# Altium project barcode Reader4.2 -version 2.PrjPcb
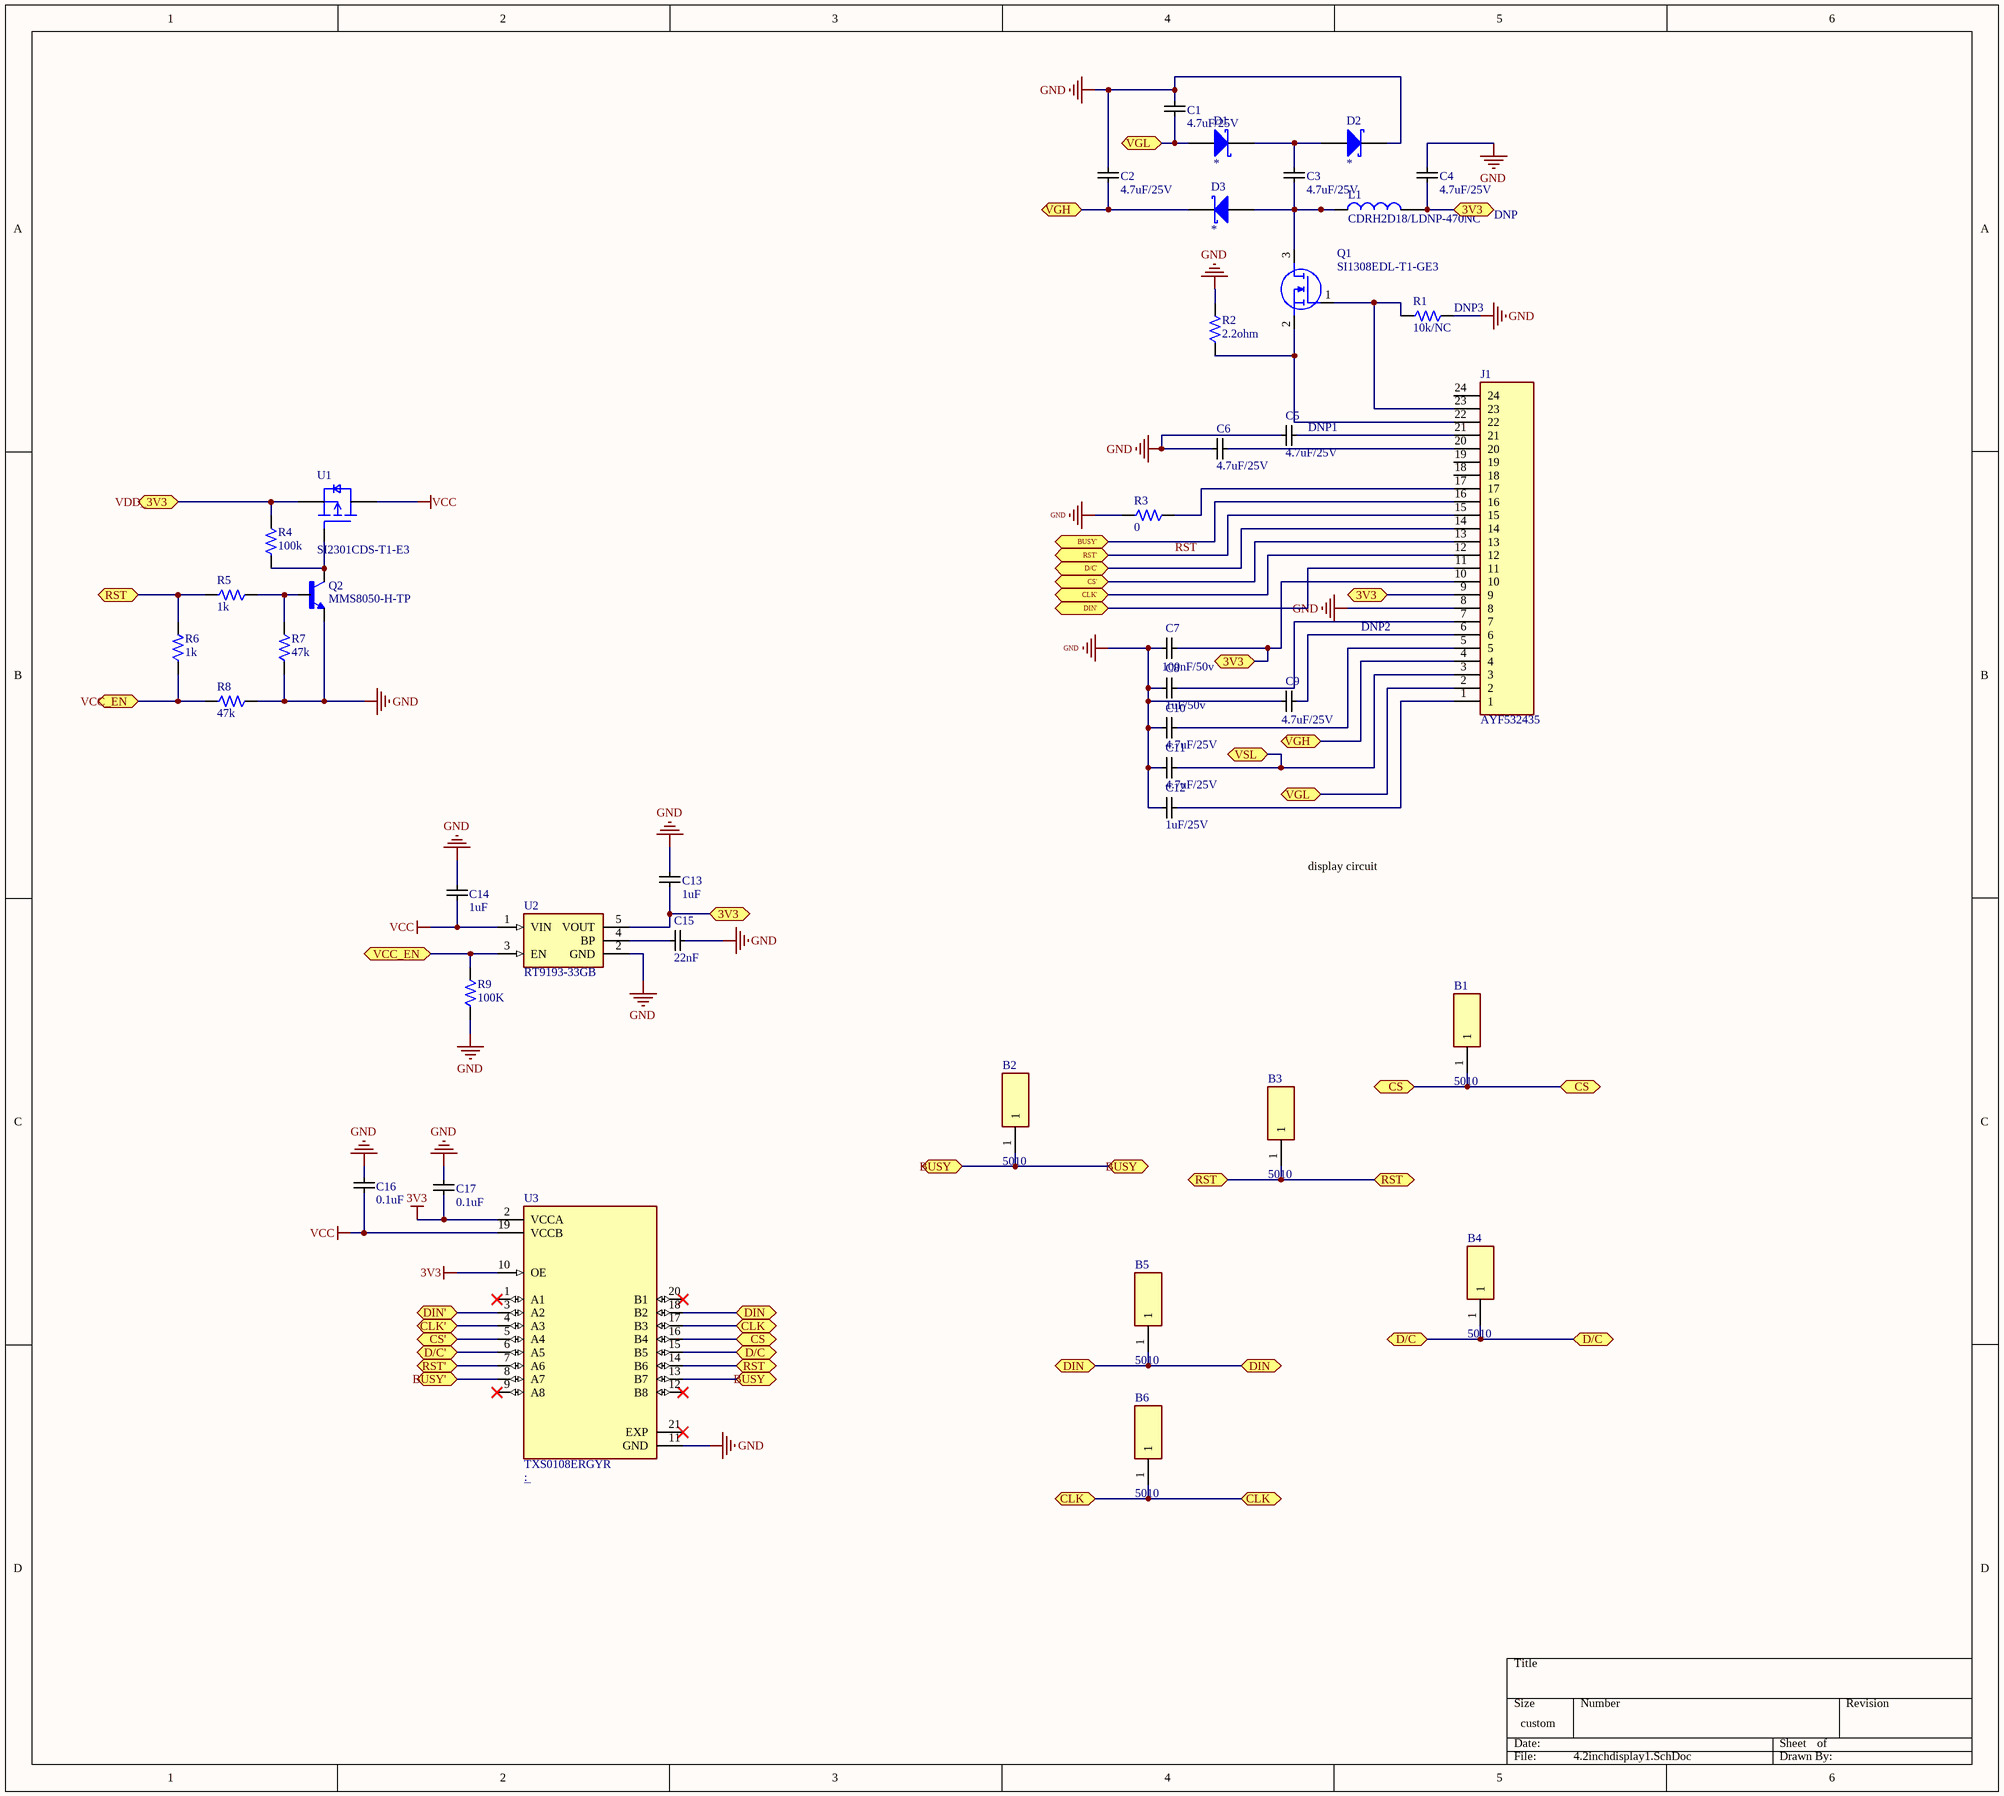
[diagram p0: 4.2inchdisplay1.SchDoc]
2 sheets, 87 parts. Net scope: flat (ports and power ports of the same name join across sheets).
Board file: 4.2inchbarcode1.PcbDoc
Sheets:
  4.2inchdisplay1.SchDoc
  microcontroller_board2.SchDoc

## Sheet 4.2inchdisplay1.SchDoc
size 381 x 341 mm; SheetNumber: 1; SheetTotal: 2

### Parts
B1  5010  [5010]
B2  5010  [5010]
B3  5010  [5010]
B4  5010  [5010]
B5  5010  [5010]
B6  5010  [5010]
C1  4.7uF/25V  [Cap_0805]
C2  4.7uF/25V  [Cap_0805]
C3  4.7uF/25V  [Cap_0805]
C4  4.7uF/25V  [Cap_0805]
C5  4.7uF/25V  [Cap_0805]
C6  4.7uF/25V  [Cap_0805]
C7  100nF/50v  [Cap_0603]
C8  1uF/50v  [Cap_0603]
C9  4.7uF/25V  [Cap_0805]
C10  4.7uF/25V  [Cap_0805]
C11  4.7uF/25V  [Cap_0805]
C12  1uF/25V  [Cap_0805]
C13  1uF  [Cap_0603]
C14  1uF  [Cap_0603]
C15  22nF  [Cap_0603]
C16  0.1uF  [Cap_0603]
C17  0.1uF  [Cap_0603]
D1  *  [ON_Semi_SOD-123F_0]
D2  *  [ON_Semi_SOD-123F_0]
D3  *  [ON_Semi_SOD-123F_0]
J1  AYF532435  [PANASONIC_AYF532435]
L1  CDRH2D18/LDNP-470NC  [IND_CDRH2D18/HPNP-1R1NC]
Q1  SI1308EDL-T1-GE3  [SOT65P210X110-3N]
Q2  MMS8050-H-TP  [SOT23-BEC]
R1  10k/NC  [RES_0805]
R2  2.2ohm  [RES_0805]
R3  0  [RES_0603]
R4  100k  [RES_0603]
R5  1k  [RES_0603]
R6  1k  [RES_0603]
R7  47k  [RES_0603]
R8  47k  [RES_0603]
R9  100K  [RES_0603]
U1  SI2301CDS-T1-E3  [SOT23-3]
U2  RT9193-33GB  [SOT94P279X129-5N]
U3  TXS0108ERGYR  [IC_TXS0108ERGYR]

### Ports
3V3 (bidir), BUSY (bidir), BUSY' (bidir), CLK (bidir), CLK' (bidir), CS (bidir), CS' (bidir), D/C (bidir), D/C' (bidir), DIN (bidir), DIN' (bidir), RST (bidir), RST' (bidir), VCC_EN (bidir), VDD_3V3 (bidir), VGH (bidir), VGL (bidir), VSL (bidir)

### Nets
3V3: C17.2 U3.2(VCCA) U3.10(OE)
GND: C1.2 C2.2 C4.2 C5.1 C6.1 C7.1 C8.1 C9.1 C10.1 C11.1 C12.1 C13.2 C14.2 C15.2 C16.2 C17.1 D2.1(K) J1.8 Q2.E R1.2 R2.2 R3.1 R7.1 R8.2 R9.1 U2.2(GND) U3.11(GND)
VCC: C14.1 C16.1 U1.3(D) U2.1(VIN) U3.19(VCCB)
RST: J1.15 U3.7(A6) ; port RST'
NetB1_1: B1.1 U3.16(B4) ; port CS
NetB2_1: B2.1 U3.13(B7) ; port BUSY
NetB3_1: B3.1 R5.1 R6.2 U3.14(B6) ; port RST
NetB4_1: B4.1 U3.15(B5) ; port D/C
NetB5_1: B5.1 U3.18(B2) ; port DIN
NetB6_1: B6.1 U3.17(B3) ; port CLK
NetC1_1: C1.1 D1.2(A) J1.2 ; port VGL
NetC2_1: C2.1 D3.1(K) J1.4 ; port VGH
NetC3_1: C3.1 D3.2(A) L1.1 Q1.3(D)
NetC3_2: C3.2 D1.1(K) D2.2(A)
NetC4_1: C4.1 C7.2 C13.1 J1.9 J1.10 L1.2 U2.5(VOUT) ; port 3V3
NetC5_2: C5.2 J1.21
NetC6_2: C6.2 J1.20
NetC8_2: C8.2 J1.7
NetC9_2: C9.2 J1.6
NetC10_2: C10.2 J1.5
NetC11_2: C11.2 J1.3 ; port VSL
NetC12_2: C12.2 J1.1
NetC15_1: C15.1 U2.4(BP)
NetJ1_11: J1.11 U3.3(A2) ; port DIN'
NetJ1_12: J1.12 U3.4(A3) ; port CLK'
NetJ1_13: J1.13 U3.5(A4) ; port CS'
NetJ1_14: J1.14 U3.6(A5) ; port D/C'
NetJ1_16: J1.16 U3.8(A7) ; port BUSY'
NetJ1_17: J1.17 R3.2
NetJ1_22: J1.22 Q1.2(S) R2.1
NetJ1_23: J1.23 Q1.1(G) R1.1
NetQ2_B: Q2.B R5.2 R7.2
NetQ2_C: Q2.C R4.1 U1.1(G)
NetR4_2: R4.2 U1.2(S) ; port VDD_3V3
NetR6_1: R6.1 R8.1 R9.2 U2.3(EN) ; port VCC_EN

Not connected (* = marked no-connect by the designer): J1 18 19 24; U3 1(A1)* 9(A8)* 12(B8)* 20(B1)* 21(EXP)*

### Notes on the sheet
- DNP
- (near R1) DNP3
- (near C5) DNP1
- DNP2
- display circuit

### Library data of the parts
B1-B6 = 5010: KEYSTONE - 5010 - TEST POINT, PCB, THROUGH HOLE; Manufacturer_Name: Keystone Electronics; Geometry.Height: 8.28mm; Manufacturer_Part_Number: 5010; Mouser Part Number: 534-5010; Mouser Price/Stock: https://www.mouser.co.uk/ProductDetail/Keystone-Electronics/5010?qs=qOqV1E1P08SzD%252BWfk1wMXQ%3D%3D; Arrow Part Number: 5010; Arrow Price/Stock: https://www.arrow.com/en/products/5010/keystone-electronics?region=europe; Datasheet Link: http://www.farnell.com/datasheets/1703983.pdf; MP: 5010
C1-C6 = CAP_0805: MP: KAM15AR71H104KM; Voltage Rating: *; Tolerance: *; Package Size: CAP_0805; Capacitance: *
  C5 C6: Parameter 1: *
C7 = CAP_0603: KAM15AR71H104KM; Voltage Rating: *; Tolerance: *; Package Size: CAP_0603; MP: KAM15AR71H104KM; Parameter 1: *
C8 = CAP_0603: UMK107AB7105KA-T; Voltage Rating: *; Tolerance: *; Package Size: CAP_0603; MP: UMK107AB7105KA-T; Parameter 1: *
C9-C11 = CAP_0805: TMK212AB7475KG-T; Voltage Rating: *; Tolerance: *; Package Size: CAP_0805; Capacitance: *; MP: TMK212AB7475KG-T; Parameter 1: *
C12 = CAP_0805: MCAST21GSB7105MTNB25; Voltage Rating: *; Tolerance: *; Package Size: CAP_0805; Capacitance: *; MP: MCAST21GSB7105MTNB25; Parameter 1: *
C13 C14 = CAP_0603: GRT188R61H105KE13D; Voltage Rating: *; Tolerance: *; Package Size: CAP_0603; MP: GRT188R61H105KE13D
C15 = CAP_0603: GCM188R71H223KA37J; Voltage Rating: *; Tolerance: *; Package Size: CAP_0603; MP: GCM188R71H223KA37J
C16 = CAP_0603: MP: GCM188R71H104KA57J; Voltage Rating: *; Tolerance: *; Package Size: CAP_0603
C17 = CAP_0603: GCM188R71H104KA57J; Voltage Rating: *; Tolerance: *; Package Size: CAP_0603; MP: GCM188R71H104KA57J
D1-D3 = Schottky Diode: Schottky Barrier Rectifier, 40 V Maximum DC Blocking Voltage, -65 to 125 degC, 2-Pin SMA Case, RoHS; MF: CDRH2D18/LDNP-470NC; ComponentLink1Description: Manufacturer URL; ComponentLink2Description: Datasheet; ComponentLink3URL: http://www.vishay.com/docs/88746/ss12.pdf; ComponentLink3Description: Package Specification; ComponentLink1URL: http://www.vishay.com/; ComponentLink2URL: http://www.vishay.com/docs/88746/ss12.pdf; MP: CDRH2D18/LDNP-470NC; Value: *; Parameter 1: *
J1 = AYF532435: 24 Position FFC, FPC Connector Contacts, Top and Bottom 0.020 (0.50mm) Surface Mount, Right Angle; MF: Panasonic Electric Works; Availability: In Stock; SnapEDA_Link: https://www.snapeda.com/parts/AYF532435/Panasonic/view-part/3222527/?ref=snap; MP: AYF532435; Value: *; Price: None; Package: None; Check_prices: https://www.snapeda.com/parts/AYF532435/Panasonic/view-part/3222527/?ref=eda; Purchase-URL: https://pricing.snapeda.com/search/part/AYF532435/?ref=eda; Parameter 1: *
L1 = CDRH2D18/HPNP-1R1NC: Power Inductors - SMD 47uH 0.48A 530ohms; MF: CDRH2D18/LDNP-470NC; Package: None; Price: None; Value: *; MP: CDRH2D18/LDNP-470NC; Availability: Unavailable; Parameter 1: *
Q1 = SI1308EDL-T1-GE3: N-Channel 30V 1.4A (Tc) 400mW (Ta), 500mW (Tc) Surface Mount SC-70-3; MF: Vishay Siliconix; MP: SI1308EDL-T1-GE3; Value: *; Check_prices: https://www.snapeda.com/parts/SI1308EDL-T1-GE3/Vishay%20Siliconix/view-part/5506696/?ref=eda; SnapEDA_Link: https://www.snapeda.com/parts/SI1308EDL-T1-GE3/Vishay%20Siliconix/view-part/5506696/?ref=snap; Price: None; Availability: In Stock; Purchase-URL: https://pricing.snapeda.com/search/part/SI1308EDL-T1-GE3/?ref=eda; Package: SOT-323 Vishay Semiconductor; Parameter 1: *
Q2 = MMBT2222*: Bipolar (BJT) Transistor NPN 30 V 600 mA 250MHz 300 mW Surface Mount SOT-23-3 (TO-236); MF: ON Semiconductor; Check_prices: https://www.snapeda.com/parts/MMBT2222/Onsemi/view-part/?ref=eda; Value: *; Availability: In Stock; MP: MMS8050-H-TP; Price: None; Package: SOT-23-3 Fairchild Semiconductor; SnapEDA_Link: https://www.snapeda.com/parts/MMBT2222/Onsemi/view-part/?ref=snap; Parameter 1: *
R1 = RES_0805: AC0603FR-0710KL; Power Rating: *; Tolerance: *; Package Size: RES_0805; MP: AC0603FR-0710KL; Parameter 1: *
R2 = RES_0805: CRCW08052R20FKEAHP; Power Rating: *; Tolerance: *; Package Size: RES_0805; MP: CRCW08052R20FKEAHP; Parameter 1: *
R3 = RES_0603: AC0603FR-070RL; Power Rating: *; Tolerance: *; Package Size: *; MP: AC0603FR-070RL; Parameter 1: *
R4 R9 = RES_0603: AC0603FR-07100KL; Power Rating: *; Tolerance: *; Package Size: *; MP: AC0603FR-07100KL
R5 R6 = RES_0603: AC0603FR-071KL; Power Rating: *; Tolerance: *; Package Size: *; MP: AC0603FR-071KL
R7 = RES_0603: RC0603FR-0747KL; Power Rating: *; Tolerance: *; Package Size: *; MP: RC0603FR-0747KL
R8 = RES_0603: MP: RC0603FR-0747KL; Power Rating: *; Tolerance: *; Package Size: *
U1 = AO3401: P-Channel 30 V 4A (Ta) 1.4W (Ta) Surface Mount SOT-23-3; MF: Alpha &; SnapEDA_Link: https://www.snapeda.com/parts/AO3401/Alpha+%2526+Omega+Semiconductor+Inc./view-part/?ref=snap; Package: TO-236-3 Alpha &amp; Omega Semiconductor Inc.; Value: *; MP: SI2301CDS-T1-E3; Check_prices: https://www.snapeda.com/parts/AO3401/Alpha+%2526+Omega+Semiconductor+Inc./view-part/?ref=eda; Parameter 1: *
U2 = RT9193-33GB: Linear Voltage Regulator IC Positive Fixed 1 Output 300mA TSOT-23-5; MF: Richtek USA; SnapEDA_Link: https://www.snapeda.com/parts/RT9193-33GB/Richtek+USA+Inc./view-part/?ref=snap; Package: SOT-23-5 Richtek; MP: RT9193-33GB; Check_prices: https://www.snapeda.com/parts/RT9193-33GB/Richtek+USA+Inc./view-part/?ref=eda; Purchase-URL: https://pricing.snapeda.com/search/part/RT9193-33GB/?ref=eda; Digi-Key_Part_Number: 1028-1014-2-ND; Value: *; Parameter 1: *
U3 = TXS0108ERGYR: 8-bit bidirectional voltage-level shifter for open-drain and push-pull application 20-VQFN -40 to 85; MF: Texas Instruments; Package: VQFN-20 Texas Instruments; Availability: Unavailable; MP: TXS0108ERGYR; SnapEDA_Link: https://www.snapeda.com/parts/TXS0108ERGYR/Texas%20Instruments/view-part/46552/?ref=snap; Purchase-URL: https://pricing.snapeda.com/search/part/TXS0108ERGYR/?ref=eda; Value: *; Price: None; Parameter 1: *

## Sheet microcontroller_board2.SchDoc
size 580 x 341 mm; SheetNumber: 2; SheetTotal: 2
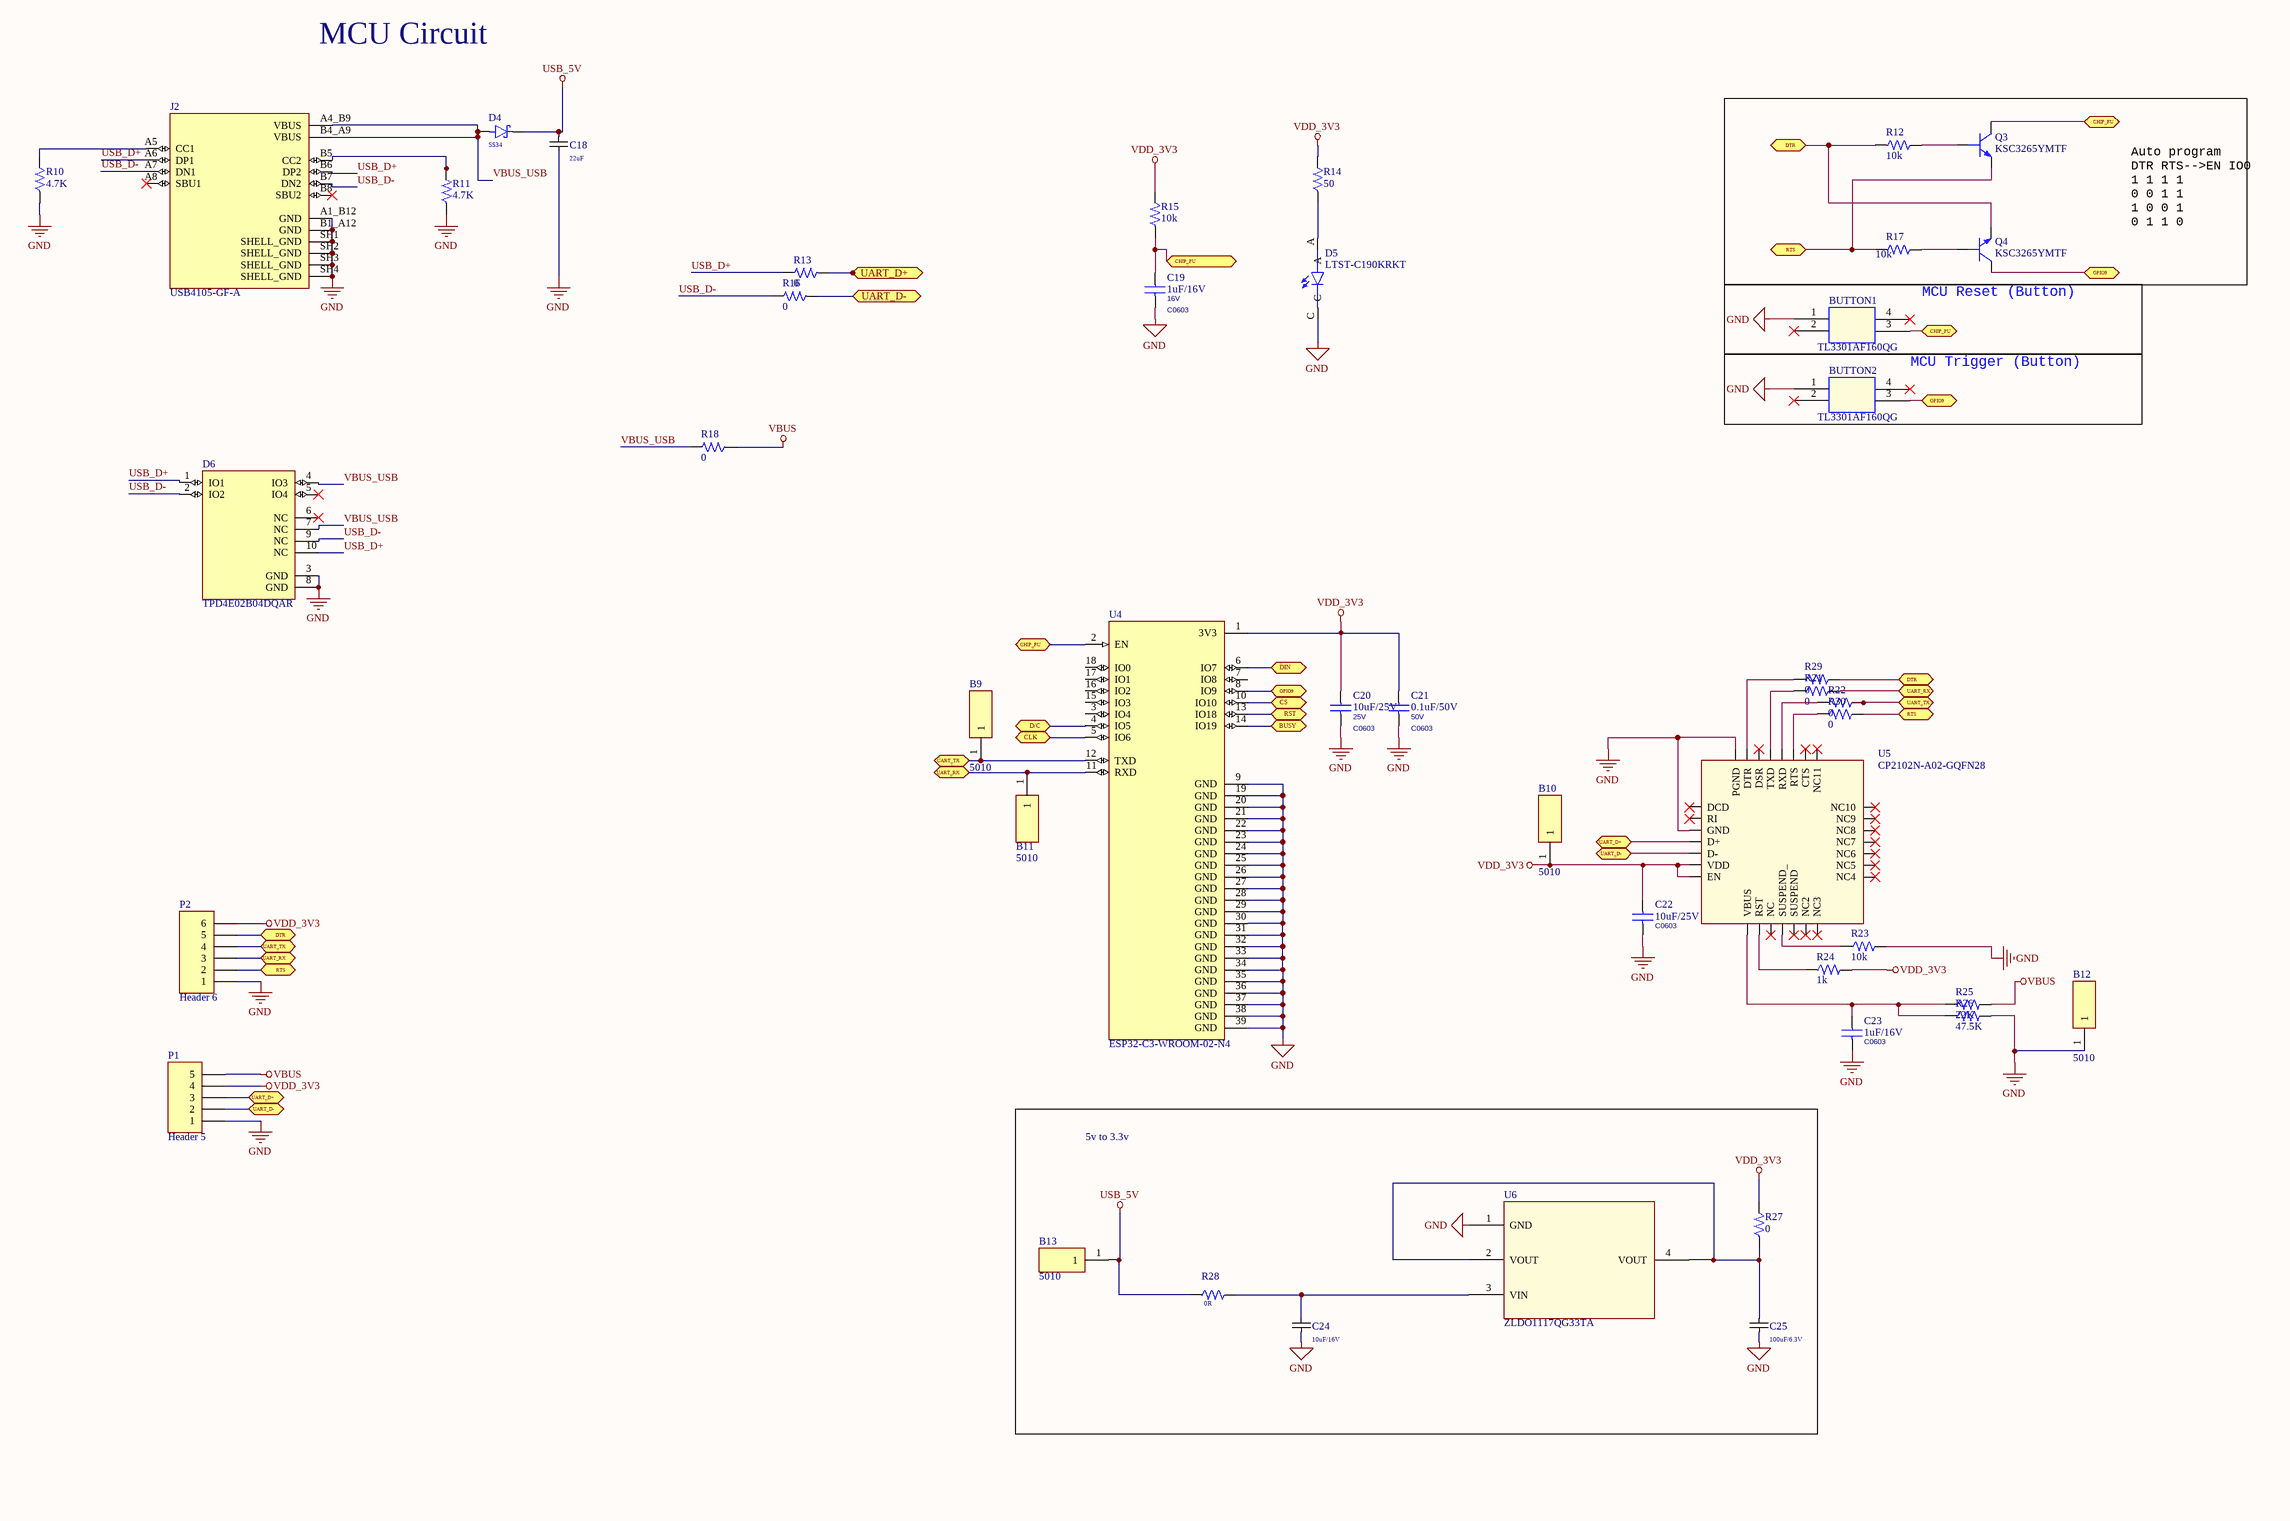
[diagram p1: microcontroller_board2.SchDoc]

### Parts
B9  5010  [5010]
B10  5010  [5010]
B11  5010  [5010]
B12  5010  [5010]
B13  5010  [5010]
BUTTON1  TL3301AF160QG  [TL3301AF160QG]
BUTTON2  TL3301AF160QG  [TL3301AF160QG]
C18  22uF  [Cap_0805]
C19  1uF/16V  PCB Footprint: C0603  Voltage: 16V  [Cap_0603]
C20  10uF/25V  Voltage: 25V  PCB Footprint: C0603  [Cap_0603]
C21  0.1uF/50V  Voltage: 50V  PCB Footprint: C0603  [Cap_0603]
C22  10uF/25V  PCB Footprint: C0603  [Cap_0603]
C23  1uF/16V  PCB Footprint: C0603  [Cap_0603]
C24  10uF/16V  [Cap_0603]
C25  100uF/6.3V  [Cap_0805]
D4  SS34  [DIOM7959X265N]
D5  LTST-C190KRKT  [LEDM1608X80]
D6  TPD4E02B04DQAR  [DIO_TPD4E02B04DQAR]
J2  USB4105-GF-A  [GCT_USB4105-GF-A]
P1  Header 5  [HDR1X5]
P2  Header 6  [HDR1X6]
Q3  KSC3265YMTF  [KSC3265YMTF]
Q4  KSC3265YMTF  [KSC3265YMTF]
R10  4.7K  [RES_0603]
R11  4.7K  [RES_0603]
R12  10k  [RES_0603]
R13  0  [RES_0603]
R14  50  [RES_0603]
R15  10k  [RES_0603]
R16  0  [RES_0603]
R17  10k  [RES_0603]
R18  0  [RES_0603]
R21  0  [RES_0603]
R22  0  [RES_0603]
R23  10k  [RES_0603]
R24  1k  [RES_0603]
R25  22K  [RES_0603]
R26  47.5K  [RES_0603]
R27  0  [RES_0603]
R28  0R  [RES_0805]
R29  0  [RES_0603]
R30  0  [RES_0603]
U4  ESP32-C3-WROOM-02-N4  [MODULE_ESP32-C3-WROOM-02-H4]
U5  CP2102N-A02-GQFN28  [CP2102N-A02-GQFN28]
U6  ZLDO1117QG33TA  [ZLDO1117QG33TA]

### Blocks framed on the sheet
MCU Reset (Button): BUTTON1
MCU Trigger (Button): BUTTON2
5v to 3.3v: B13 C24 C25 R27 R28 U6

### Ports
BUSY (bidir), CHIP_PU (bidir), CLK (bidir), CS (bidir), D/C (bidir), DIN (bidir), DTR (bidir), GPIO9 (bidir), RST (bidir), RTS (bidir), UART_D+ (bidir), UART_D- (bidir), UART_RX (bidir), UART_TX (bidir)

### Nets
GND: B12.1 BUTTON1.1(+) BUTTON2.1(+) C18.1 C19.2 C20.2 C21.2 C22.2 C23.2 C24.1 C25.1 D5.C D6.3(GND) D6.8(GND) J2.A1_B12(GND) J2.B1_A12(GND) J2.SH1(SHELL_GND) J2.SH2(SHELL_GND) J2.SH3(SHELL_GND) J2.SH4(SHELL_GND) P1.1 P2.1 R10.1 R11.1 R23.2 R26.2 U4.9(GND) U4.19(GND) U4.20(GND) U4.21(GND) U4.22(GND) U4.23(GND) U4.24(GND) U4.25(GND) U4.26(GND) U4.27(GND) U4.28(GND) U4.29(GND) U4.30(GND) U4.31(GND) U4.32(GND) U4.33(GND) U4.34(GND) U4.35(GND) U4.36(GND) U4.37(GND) U4.38(GND) U4.39(GND) U5.3(GND) U5.29(PGND) U6.1(GND)
USB_5V: B13.1 C18.2 D4.C(K) R28.1
VBUS: P1.5 R18.1 R25.2
VDD_3V3: B10.1 C20.1 C21.1 C22.1 P1.4 P2.6 R14.2 R15.2 R24.2 R27.2 U4.1(3V3) U5.6(VDD) U5.7(EN)
USB_D+: D6.1(IO1) D6.10(NC) J2.A6(DP1) J2.B6(DP2) R13.2
USB_D-: D6.2(IO2) D6.9(NC) J2.A7(DN1) J2.B7(DN2) R16.2
VBUS_USB: D4.A D6.4(IO3) D6.7(NC) J2.A4_B9(VBUS) J2.B4_A9(VBUS) R18.2
NetB1_1: U4.10(IO10) ; port CS
NetB2_1: U4.14(IO19) ; port BUSY
NetB3_1: U4.13(IO18) ; port RST
NetB4_1: U4.4(IO5) ; port D/C
NetB5_1: U4.6(IO7) ; port DIN
NetB6_1: U4.5(IO6) ; port CLK
NetB9_1: B9.1 P2.4 R22.2 U4.12(TXD) ; port UART_TX
NetB11_1: B11.1 P2.3 R21.2 U4.11(RXD) ; port UART_RX
NetBUTTON1_3: BUTTON1.3(+) C19.1 Q3.3(C) R15.1 U4.2(EN) ; port CHIP_PU
NetBUTTON2_3: BUTTON2.3(+) Q4.3(C) U4.8(IO9) ; port GPIO9
NetC23_1: C23.1 R25.1 R26.1 U5.8(VBUS)
NetC24_2: C24.2 R28.2 U6.3(VIN)
NetC25_2: C25.2 R27.1 U6.2(VOUT) U6.4(VOUT)
NetD5_A: D5.A R14.1
NetJ2_A5: J2.A5(CC1) R10.2
NetJ2_B5: J2.B5(CC2) R11.2
NetP1_2: P1.2 R16.1 U5.5(D-) ; port UART_D-
NetP1_3: P1.3 R13.1 U5.4(D+) ; port UART_D+
NetP2_2: P2.2 Q3.2(E) R17.1 R30.2 ; port RTS
NetP2_5: P2.5 Q4.2(E) R12.1 R29.2 ; port DTR
NetQ3_1: Q3.1(B) R12.2
NetQ4_1: Q4.1(B) R17.2
NetR21_1: R21.1 U5.26(TXD)
NetR22_1: R22.1 U5.25(RXD)
NetR23_1: R23.1 U5.11(SUSPEND_)
NetR24_1: R24.1 U5.9(RST)
NetR29_1: R29.1 U5.28(DTR)
NetR30_1: R30.1 U5.24(RTS)

Not connected (* = marked no-connect by the designer): BUTTON1 2(+)* 4(+)*; BUTTON2 2(+)* 4(+)*; D6 5(IO4)* 6(NC)*; J2 A8(SBU1)* B8(SBU2)*; U4 3(IO4) 7(IO8) 15(IO3) 16(IO2) 17(IO1) 18(IO0); U5 1(DCD)* 2(RI)* 10(NC)* 12(SUSPEND)* 13(NC2)* 14(NC3)* 15(NC4)* 16(NC5)* 17(NC6)* 18(NC7)* 19(NC8)* 20(NC9)* 21(NC10)* 22(NC11)* 23(CTS)* 27(DSR)*

### Notes on the sheet
- MCU Circuit
- Auto program
  DTR RTS-->EN IO0
  1 1 1 1
  0 0 1 1
  1 0 0 1
  0 1 1 0

### Library data of the parts
B9-B13 = 5010: as B1 on sheet 4.2inchdisplay1; Manufacturer_Part_Number: 5010; Mouser Part Number: 534-5010; Mouser Price/Stock: https://www.mouser.co.uk/ProductDetail/Keystone-Electronics/5010?qs=qOqV1E1P08SzD%252BWfk1wMXQ%3D%3D; Arrow Part Number: 5010; Arrow Price/Stock: https://www.arrow.com/en/products/5010/keystone-electronics?region=europe; Datasheet Link: http://www.farnell.com/datasheets/1703983.pdf; MP: 5010
BUTTON1 BUTTON2 = CON4AP_0: MP: TL3301AF160QG
C18 = CAP_0805: 810-C2012X5R1V226MAC; MP: C2012X5R1V226M125AC; Voltage Rating: *; Tolerance: *; Package Size: CAP_0805; Capacitance: *
C19 = CAP NP_Dup2: Part Number: NC_0102-1422C12; Part Name: NC_GRM155R71H104KE14D; Manufacturer: Murata; 0 LOAD CHECK 0: ¡´; Material Description: NC_CAP,ML,0.1uF,X7R,50V,0402,K%,MU,RoHS; EIAJ: C0402; Tolerance: ¡Ó10%; Characteristics: X7R; GeometryHeight: 0.55mm; MP: GRT188R71C105KE13D; Part Type: Capacitor; Distributor: ¹ñ´I; Distributor1: ·ç±¶; Distributor2: ¬ü©_
C20 = CAP NP_Dup2: Part Number: NC_0102-1422C12; Part Name: GRM188R61E106MA73J; Manufacturer: Murata; 0 LOAD CHECK 0: ¡´; Material Description: NC_CAP,ML,0.1uF,X7R,50V,0402,K%,MU,RoHS; EIAJ: C0402; Tolerance: ¡Ó10%; Characteristics: X7R; GeometryHeight: 0.55mm; Part Type: Capacitor; Distributor: ¹ñ´I; Distributor1: ·ç±¶; Distributor2: ¬ü©_; MP: GRM188R61E106MA73J
C21 = CAP NP_Dup2: Part Number: NC_0102-1422C12; Part Name: NC_GRM155R71H104KE14D; Manufacturer: Murata; 0 LOAD CHECK 0: ¡´; Material Description: NC_CAP,ML,0.1uF,X7R,50V,0402,K%,MU,RoHS; EIAJ: C0402; Tolerance: ¡Ó10%; Characteristics: X7R; GeometryHeight: 0.55mm; MP: GCM188R71H104KA57J; Part Type: Capacitor; Distributor: ¹ñ´I; Distributor1: ·ç±¶; Distributor2: ¬ü©_
C22 = CAP NP_Dup2: GRM188R61E106MA73J; Manufacturer: Murata; Part Name: NC_GRM155R71H104KE14D; Part Number: NC_0102-1422C12; GeometryHeight: 0.55mm; Characteristics: X7R; Voltage: 16V; Tolerance: ¡Ó10%; EIAJ: C0402; Material Description: NC_CAP,ML,0.1uF,X7R,50V,0402,K%,MU,RoHS; 0 LOAD CHECK 0: ¡´; Distributor2: ¬ü©_; Distributor1: ·ç±¶; Distributor: ¹ñ´I; Part Type: Capacitor; MP: GRM188R61E106MA73J
C23 = CAP NP_Dup2: GRT188R71C105KE13D; Manufacturer: Murata; Part Name: NC_GRM155R71H104KE14D; Part Number: NC_0102-1422C12; GeometryHeight: 0.55mm; Characteristics: X7R; Voltage: 16V; Tolerance: ¡Ó10%; EIAJ: C0402; Material Description: NC_CAP,ML,0.1uF,X7R,50V,0402,K%,MU,RoHS; 0 LOAD CHECK 0: ¡´; Distributor2: ¬ü©_; Distributor1: ·ç±¶; Distributor: ¹ñ´I; Part Type: Capacitor; MP: GRT188R71C105KE13D
C24 = CAP_0603: C54; MP: GRM188R61C106MAALD; Voltage Rating: *; Tolerance: *; Package Size: CAP_0603
C25 = CAP_0805: GRM21BR60J107ME15K; Voltage Rating: *; Tolerance: *; Package Size: CAP_0805; Capacitance: *; MP: GRM21BR60J107ME15K
D4 = SS34: Diode Schottky 40 V 3A Surface Mount SMC (DO-214AB); MF: onsemi; SnapEDA_Link: https://www.snapeda.com/parts/SS34/Onsemi/view-part/?ref=snap; Package: SMC-2 ON Semiconductor; Value: *; MP: SS34; Check_prices: https://www.snapeda.com/parts/SS34/Onsemi/view-part/?ref=eda; Parameter 1: *
D5 = HSMS-C190: Red 626nm LED Indication - Discrete 2.1V 0603 _1608 Metric_; MF: Broadcom Limited; MP: LTST-C190KRKT; Value: *; Package: 0603 Broadcom; Price: None; Availability: Unavailable; SnapEDA_Link: https://www.snapeda.com/parts/HSMS-C190/Broadcom%20Limited/view-part/1781258/?ref=snap; Parameter 1: *
D6 = TPD4E02B04DQAR: 4-channel ESD protection diode for USB Type-C and HDMI 2.0 10-USON -40 to 125; MF: Texas Instruments; Value: *; MP: TPD4E02B04DQAR; Package: USON-10 Texas Instruments; Purchase-URL: https://pricing.snapeda.com/search/part/TPD4E02B04DQAR/?ref=eda; SnapEDA_Link: https://www.snapeda.com/parts/TPD4E02B04DQAR/Texas%20Instruments/view-part/576424/?ref=snap; Check_prices: https://www.snapeda.com/parts/TPD4E02B04DQAR/Texas%20Instruments/view-part/576424/?ref=eda; Digi-Key_Part_Number: 296-43875-1-ND; Parameter 1: *
J2 = USB4105-GF-A: USB-C (USB TYPE-C) USB 2.0 Receptacle Connector 24 (16+8 Dummy) Position Surface Mount, Right Angle; Through Hole; MF: GCT; SnapEDA_Link: https://www.snapeda.com/parts/USB4105-GF-A/Global+Connector+Technology/view-part/?ref=snap; Package: None; Value: *; MP: USB4105-GF-A; Check_prices: https://www.snapeda.com/parts/USB4105-GF-A/Global+Connector+Technology/view-part/?ref=eda; Parameter 1: *
P1 = Header 5: Header, 5-Pin; LatestRevisionDate: 17-Jul-2002; LatestRevisionNote: Re-released for DXP Platform.; Publisher: Altium Limited; Parameter 1: *
P2 = Header 6: Header, 6-Pin; LatestRevisionDate: 17-Jul-2002; LatestRevisionNote: Re-released for DXP Platform.; Publisher: Altium Limited; Parameter 1: *
Q3 Q4 = KSC3265YMTF: Bipolar Transistors - BJT NPN Epitaxial Transistor; MP: KSC3265YMTF
R10-R12 R15 R17 R21-R26 R29 R30 = RES_0603: Power Rating: *; Tolerance: *; Package Size: *
R13 R16 R18 R27 = RES_0603: MP: AC0603FR-070RL; Power Rating: *; Tolerance: *; Package Size: *
R14 = RES_0603: MP: RT0603BRE0750RL; Power Rating: *; Tolerance: *; Package Size: *
R28 = RES_0805: RC0805JR-070RL; Power Rating: *; Tolerance: *; Package Size: RES_0805; MP: RC0805JR-070RL
U4 = ESP32-C3-WROOM-02-N4: WiFi Modules (802.11) (Engineering Samples) SMD module, ESP32-C3, 4MB SPI flash, PCB antenna, -40 C +85 C; MF: Espressif Systems; Value: *; SnapEDA_Link: https://www.snapeda.com/parts/ESP32-C3-WROOM-02-N4/Espressif+Systems/view-part/?ref=snap; Purchase-URL: https://pricing.snapeda.com/search/part/ESP32-C3-WROOM-02-N4/?ref=eda; Availability: In Stock; Price: None; Package: Package; Check_prices: https://www.snapeda.com/parts/ESP32-C3-WROOM-02-N4/Espressif+Systems/view-part/?ref=eda; MP: ESP32-C3-WROOM-02-N4; Parameter 1: *
U5 = CP2102N-A02-GQFN28: USB Interface IC USBXpress - USB to UART Bridge; MP: CP2102N-A02-GQFN28
U6 = ZLDO1117QG33TA: A low dropout, high speed, positive adjustable or fixed-mode (3.3V) / regulator with 1A output current capability.; MP: ZLDO1117QG33TA

## Nets that join several sheets
GND: 4.2inchdisplay1 (27 pins), microcontroller_board2 (51 pins)
NetB1_1: 4.2inchdisplay1 (B1.1 U3.16), microcontroller_board2 (U4.10)
NetB2_1: 4.2inchdisplay1 (B2.1 U3.13), microcontroller_board2 (U4.14)
NetB3_1: 4.2inchdisplay1 (B3.1 R5.1 R6.2 U3.14), microcontroller_board2 (U4.13)
NetB4_1: 4.2inchdisplay1 (B4.1 U3.15), microcontroller_board2 (U4.4)
NetB5_1: 4.2inchdisplay1 (B5.1 U3.18), microcontroller_board2 (U4.6)
NetB6_1: 4.2inchdisplay1 (B6.1 U3.17), microcontroller_board2 (U4.5)